# Altium schematic sheet Mainboard_User_Interface.SchDoc
size A4
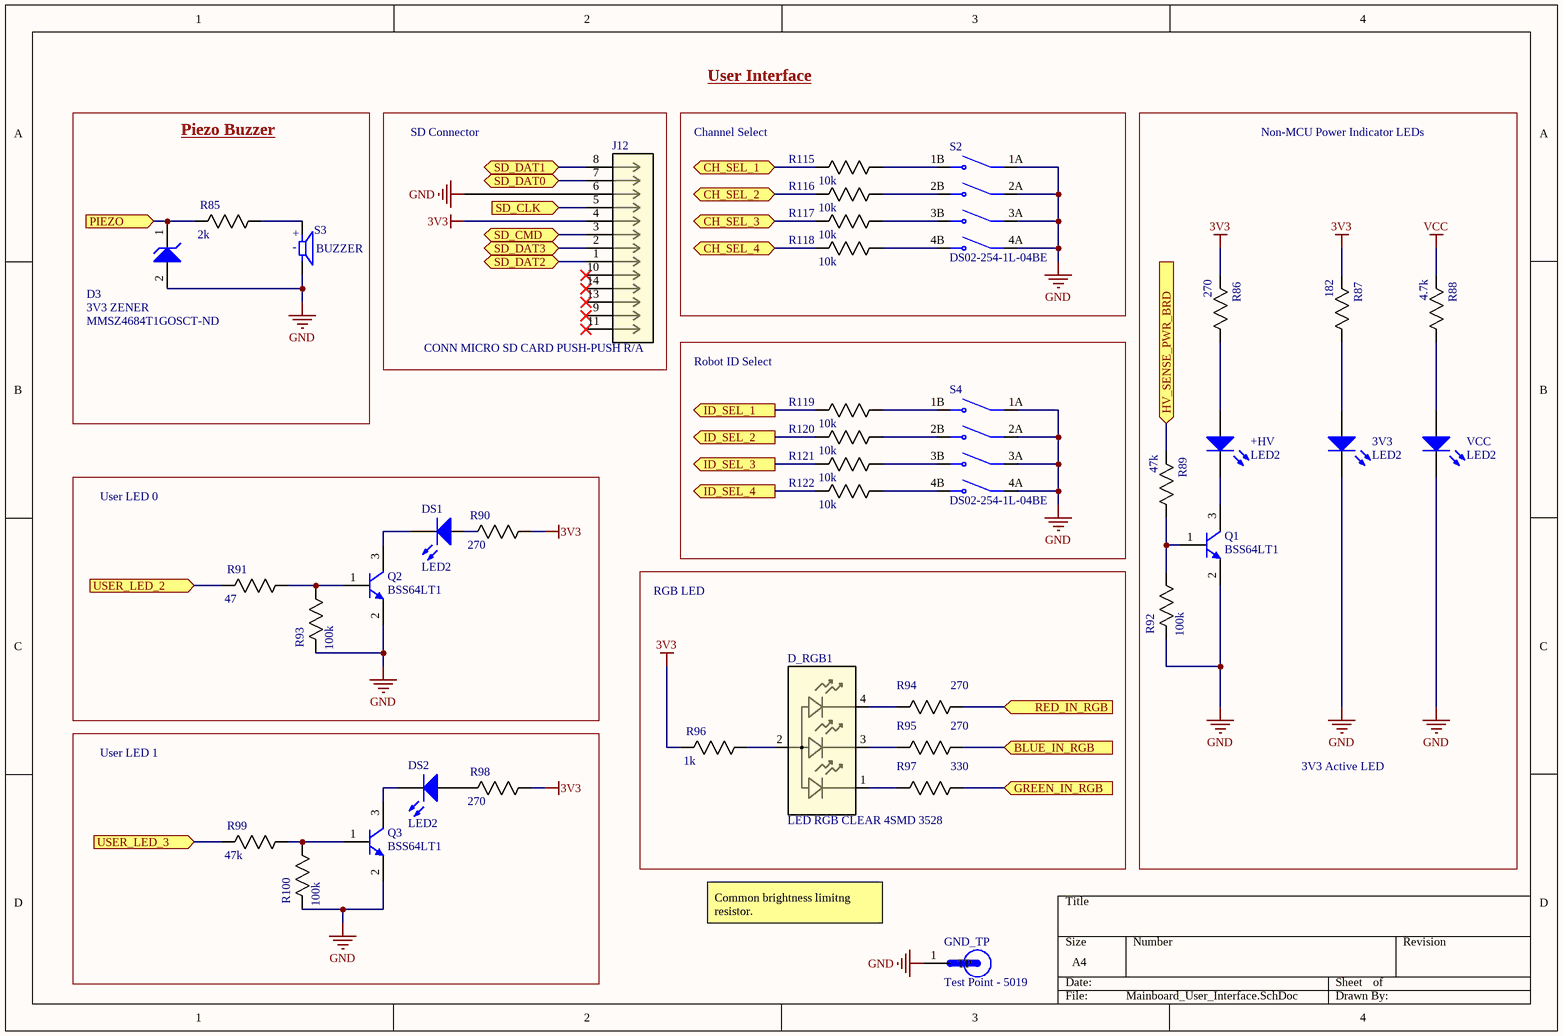
[diagram p0: Mainboard_User_Interface.SchDoc]

## Parts
3V3  LED2  [3.2X1.6X1.1]
+HV  LED2  [3.2X1.6X1.1]
D3  3V3 ZENER  Supplier Part Number 1: MMSZ4684T1GOSCT-ND  [ONSC-SOD-123-2-425-04_V]
D_RGB1  LED RGB CLEAR 4SMD 3528  [LED 4pin 3.5 x 2.8]
DS1  LED2  [3.2X1.6X1.1]
DS2  LED2  [3.2X1.6X1.1]
GND_TP  Test Point - 5019  [TP380X203]
J12  CONN MICRO SD CARD PUSH-PUSH R/A  [SD Connector 5027740891]
Q1  BSS64LT1  [ONSC-SOT-23-3-318-08_V]
Q2  BSS64LT1  [ONSC-SOT-23-3-318-08_V]
Q3  BSS64LT1  [ONSC-SOT-23-3-318-08_V]
R85  2k  [0603]
R86  270  [0603]
R87  182  [0603]
R88  4.7k  [0603]
R89  47k  [0603]
R90  270  [0603]
R91  47  [0603]
R92  100k  [0603]
R93  100k  [0603]
R94  270  [0603]
R95  270  [0603]
R96  1k  [0603]
R97  330  [0603]
R98  270  [0603]
R99  47k  [0603]
R100  100k  [0603]
R115  10k  [0603]
R116  10k  [0603]
R117  10k  [0603]
R118  10k  [0603]
R119  10k  [0603]
R120  10k  [0603]
R121  10k  [0603]
R122  10k  [0603]
S2  DS02-254-1L-04BE  [SW_DS02-254-1L-04BE]
S3  BUZZER  [BUZZER PKM13EPYH4000-A0]
S4  DS02-254-1L-04BE  [SW_DS02-254-1L-04BE]
VCC  LED2  [3.2X1.6X1.1]

## Blocks framed on the sheet
Piezo Buzzer: D3 R85 S3
SD Connector: J12
Channel Select: R115-R118 S2
Robot ID Select: R119-R122 S4
User LED 0: DS1 Q2 R90 R91 R93
RGB LED: D_RGB1 R94-R97
User LED 1: DS2 Q3 R98-R100

## Ports
BLUE_IN_RGB (in), CH_SEL_1 (bidir), CH_SEL_2 (bidir), CH_SEL_3 (bidir), CH_SEL_4 (bidir), GREEN_IN_RGB (in), HV_SENSE_PWR_BRD (in), ID_SEL_1 (out), ID_SEL_2 (out), ID_SEL_3 (out), ID_SEL_4 (out), PIEZO (in), RED_IN_RGB (in), SD_CLK (in), SD_CMD (bidir), SD_DAT0 (bidir), SD_DAT1 (bidir), SD_DAT2 (bidir), SD_DAT3 (bidir), USER_LED_2 (in), USER_LED_3 (in)

## Nets
3V3: J12.4 R86.2(R2) R87.2(R2) R90.1(R1) R96.2(R2) R98.1(R1)
GND: 3V3.2(K) D3.2(A) GND_TP.1(TP) J12.6 Q1.2(E) Q2.2(E) Q3.2(E) R92.2(R2) R93.2(R2) R100.2(R2) S2.1A(COM1) S2.2A(COM2) S2.3A(COM3) S2.4A(COM4) S3.N S4.1A(COM1) S4.2A(COM2) S4.3A(COM3) S4.4A(COM4) VCC.2(K)
VCC: R88.2(R2)
BLUE_IN_RGB: R95.1(R1) ; port BLUE_IN_RGB
CH_SEL_1: R115.2(R2) ; port CH_SEL_1
CH_SEL_2: R116.2(R2) ; port CH_SEL_2
CH_SEL_3: R117.2(R2) ; port CH_SEL_3
CH_SEL_4: R118.2(R2) ; port CH_SEL_4
GREEN_IN_RGB: R97.1(R1) ; port GREEN_IN_RGB
HV_SENSE_PWR_BRD: R89.2(R2) ; port HV_SENSE_PWR_BRD
ID_SEL_1: R119.2(R2) ; port ID_SEL_1
ID_SEL_2: R120.2(R2) ; port ID_SEL_2
ID_SEL_3: R121.2(R2) ; port ID_SEL_3
ID_SEL_4: R122.2(R2) ; port ID_SEL_4
PIEZO: D3.1(K) R85.2(R2) ; port PIEZO
RED_IN_RGB: R94.1(R1) ; port RED_IN_RGB
SD_CLK: J12.5 ; port SD_CLK
SD_CMD: J12.3 ; port SD_CMD
SD_DAT0: J12.7 ; port SD_DAT0
SD_DAT1: J12.8 ; port SD_DAT1
SD_DAT2: J12.1 ; port SD_DAT2
SD_DAT3: J12.2 ; port SD_DAT3
USER_LED_2: R91.2(R2) ; port USER_LED_2
USER_LED_3: R99.2(R2) ; port USER_LED_3
Net3V3_1: 3V3.1(A) R87.1(R1)
Net+HV_1: +HV.1(A) R86.1(R1)
Net+HV_2: +HV.2(K) Q1.3(C)
NetD_RGB1_1: D_RGB1.1 R97.2(R2)
NetD_RGB1_2: D_RGB1.2 R96.1(R1)
NetD_RGB1_3: D_RGB1.3 R95.2(R2)
NetD_RGB1_4: D_RGB1.4 R94.2(R2)
NetDS1_1: DS1.1(A) R90.2(R2)
NetDS1_2: DS1.2(K) Q2.3(C)
NetDS2_1: DS2.1(A) R98.2(R2)
NetDS2_2: DS2.2(K) Q3.3(C)
NetQ1_1: Q1.1(B) R89.1(R1) R92.1(R1)
NetQ2_1: Q2.1(B) R91.1(R1) R93.1(R1)
NetQ3_1: Q3.1(B) R99.1(R1) R100.1(R1)
NetR85_1: R85.1(R1) S3.P
NetR88_1: R88.1(R1) VCC.1(A)
NetR115_1: R115.1(R1) S2.1B(NO1)
NetR116_1: R116.1(R1) S2.2B(NO2)
NetR117_1: R117.1(R1) S2.3B(NO3)
NetR118_1: R118.1(R1) S2.4B(NO4)
NetR119_1: R119.1(R1) S4.1B(NO1)
NetR120_1: R120.1(R1) S4.2B(NO2)
NetR121_1: R121.1(R1) S4.3B(NO3)
NetR122_1: R122.1(R1) S4.4B(NO4)

Not connected (* = marked no-connect by the designer): J12 9* 10* 11* 13* 14*

## Notes on the sheet
- User Interface
- Non-MCU Power Indicator LEDs
- 3V3 Active LED
- Common brightness limitng resistor.
- (in symbol BUZZER PKM13EPYH4000-A0) +; -

## Library data of the parts
3V3 +HV DS1 VCC = LED GREEN SMD: Typical RED, GREEN, YELLOW, AMBER GaAs LED; Voltage - Forward (Vf) (Typ): 2V; Lens Transparency: Clear; Current - Test: 20mA; Package: 1206; Color: Green
D3 = DIODE ZENER 3.3 500mW: Zener 3V3 Voltage Regulator, 500 mW, 2-Pin SOD-123, Pb-Free, Tape and Reel; PartNumber: MMSZ4684T1G; Manufacturer: On Semiconductor; P Max (W): 0.5; VZ Typ (V): 3.3; ComponentLink2URL: http://www.onsemi.com/pub_link/Collateral/MMSZ4678T1-D.PDF; ComponentLink1URL: http://www.onsemi.com/; ComponentLink2Description: Datasheet; ComponentLink3URL: http://www.onsemi.com/pub_link/Collateral/425-04.PDF; DatasheetVersion: Rev. 9; ComponentLink1Description: Manufacturer URL; RoHS: Pb-Free; ComponentLink3Description: Package Specification; PackageReference: SOD-123-2-425-04; PackageVersion: Rev. G, 10/2009; Mounting Technology: Surface Mount; Packing: Tape and Reel; PackageDescription: 2-Pin SOD, Body 1.6 x 2.69 mm; Supplier 1: Digi-Key
D_RGB1 = LED RGB CLEAR 4SMD 3528: LED RGB No Lead / AAA3528
DS2 = LED RED SMD: Typical RED, GREEN, YELLOW, AMBER GaAs LED; Lens Color: Colorless; Voltage - Forward (Vf) (Typ): 1.7V; Current - Test: 20mA; Lens Transparency: Clear; Package: 1206; Color: Red
GND_TP = Test Point - 5019: PC Test Point, Miniature Phosphor Bronze, Silver Plating Surface Mount Mounting Type; MP: 5019; MF: Keystone Electronics; Value: *; Package: 2010 Keystone; Digi-Key_Part_Number: 36-5019CT-ND; Digi-Key_Purchase_URL: https://www.digikey.com/product-detail/en/keystone-electronics/5019/36-5019CT-ND/3907344?utm_source=snapeda&utm_medium=aggregator&utm_campaign=symbol
J12 = CONN MICRO SD CARD PUSH-PUSH R/A: 10 (8 + 2) Position Card Connector Secure Digital - microSD™ Surface Mount, Right Angle Gold; MF: Molex; MP: 5027740891; ComponentLink1Description: Digikey; ComponentLink1URL: https://www.digikey.ca/en/products/detail/molex/5027740891/1952536; Digikey: WM24066CT-ND; ComponentLink2Description: Datasheet; ComponentLink2URL: https://www.molex.com/pdm_docs/sd/5027740891_sd.pdf
Q1-Q3 = CMP-1048-00605-1: Driver Transistor, NPN Silicon, 3-Pin SOT-23, Tape and Reel; Manufacturer: On Semiconductor; IC Continuous (A): 0.1; fT Min (MHz): 60; ComponentLink1Description: Manufacturer URL; ComponentLink3Description: Package Specification; ComponentLink2URL: http://www.onsemi.com/pub_link/Collateral/BSS64LT1-D.PDF; ComponentLink1URL: http://www.onsemi.com/; ComponentLink2Description: Datasheet; ComponentLink3URL: http://www.onsemi.cn/pub_link/Collateral/318-08.PDF; RoHS: FALSE; PackageVersion: Rev. AP, 11/2009; Polarity: NPN; PartNumber: BSS64LT1; Mounting Technology: Surface Mount; PackageDescription: 3-Pin Small Outline Transistor, Body 2.92 x 1.3 mm, Pitch 0.95 mm; Packing: Tape and Reel; DatasheetVersion: Rev. 5; PackageReference: SOT-23-3-318-08
R85 = RES 2k 1/8W: RES SMD 2K OHM 5% 1/8W 0805; Power (Watts): 0.125W; Package: 0805; Value: 2k; Tolerance: 5%
R86 R90 R94 R95 R98 = RES 270.0 1/8W: RES SMD 270 OHM 5% 1/8W 0805; Power (Watts): 0.125W; Package: 0805; Value: 270; Tolerance: 5%
R87 = RES 182.0 1/8W: RES SMD 182 OHM 1% 1/8W 0805; Power (Watts): 0.125W; Package: 0805; Value: 182; Tolerance: 1%
R88 = RES 4.7k 1/8W - 5%: RES SMD 4.7k OHM 5% 1/8W 0805; Power (Watts): 0.125W; Package: 0805; Value: 4.7k; Tolerance: 5%
R89 R99 = RES 47k 1/8W - 1%: RES SMD 47K OHM 1% 1/8W 0805; Power (Watts): 0.125W; Package: 0805; Value: 47k; Tolerance: 1%
R91 = RES 47.0 1/8W - 1%: RES SMD 47 OHM 1% 1/8W 0805; Power (Watts): 0.125W; Package: 0805; Value: 47; Tolerance: 1%
R92 R93 R100 = RES 100k 1/8W - 1%: RES SMD 100K OHM 1% 1/8W 0805; Power (Watts): 0.125W; Package: 0805; Value: 100k; Tolerance: 1%
R96 = RES 1k 1/8W: RES SMD 1K OHM 5% 1/8W 0805; Power (Watts): 0.125W; Package: 0805; Value: 1k; Tolerance: 5%
R97 = RES 330.0 1/8W - 1%: RES SMD 330 OHM 1% 1/8W 0805; Rating: 0.125W; Package: 0805; Value: 330; Tolerance: 1%
R115-R122 = RES 10k 1/8W - 1%: RES SMD 10K OHM 1% 1/8W 0805; Power (Watts): 0.125W; Package: 0805; Value: 10k; Tolerance: 1%
S2 S4 = DS02-254-1L-04BE: Dip Switch Piano Key 4-position; Package: None; Price: None; Value: *; MP: DS02-254-1L-04BE; Availability: Unavailable
S3 = BUZZER PKM13EPYH4000-A0: Buzzers Transducer, Externally Driven Piezo 1.5V 4kHz 70dB @ 1.5V, 10cm Through Hole PC Pins; MF: Murata; Arrow_Electronics-Purchase-URL: https://snapeda.com/shop?store=Arrow+Electronics&id=4970420; Value: *; SnapEDA_Link: https://www.snapeda.com/parts/PKM13EPYH4000-A0/Murata/view-part/4970420/?ref=snap; Package: Radial-2 Murata; MP: PKM13EPYH4000-A0; Digikey Part: 490-4698-1-ND